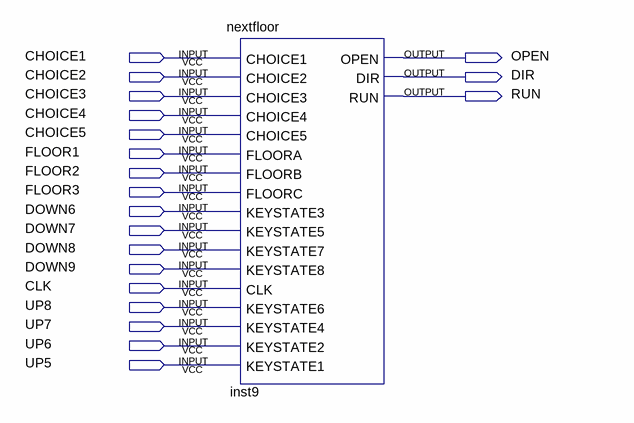
[diagram p0: schematic sheet]
// Quartus schematic test_1.bdf as structural Verilog: 1 symbols, 20 pins
module test_1 (
  input  CHOICE1,
  input  CHOICE2,
  input  CHOICE3,
  input  CHOICE4,
  input  CHOICE5,
  input  FLOOR1,
  input  FLOOR2,
  input  FLOOR3,
  input  DOWN6,
  input  DOWN7,
  input  DOWN8,
  input  DOWN9,
  input  CLK,
  input  UP8,
  input  UP7,
  input  UP6,
  input  UP5,
  output OPEN,
  output DIR,
  output RUN
);

  nextfloor inst9 (
    .CHOICE1(CHOICE1), .CHOICE2(CHOICE2), .CHOICE3(CHOICE3), .CHOICE4(CHOICE4), .CHOICE5(CHOICE5),
    .FLOORA(FLOOR1), .FLOORB(FLOOR2), .FLOORC(FLOOR3), .KEYSTATE3(DOWN6), .KEYSTATE5(DOWN7),
    .KEYSTATE7(DOWN8), .KEYSTATE8(DOWN9), .CLK(CLK), .KEYSTATE6(UP8), .KEYSTATE4(UP7), .KEYSTATE2(UP6),
    .KEYSTATE1(UP5), .OPEN(OPEN), .DIR(DIR), .RUN(RUN));
endmodule
